# Altium schematic sheet 智能家居-窗帘-电力板.SchDoc
size A4
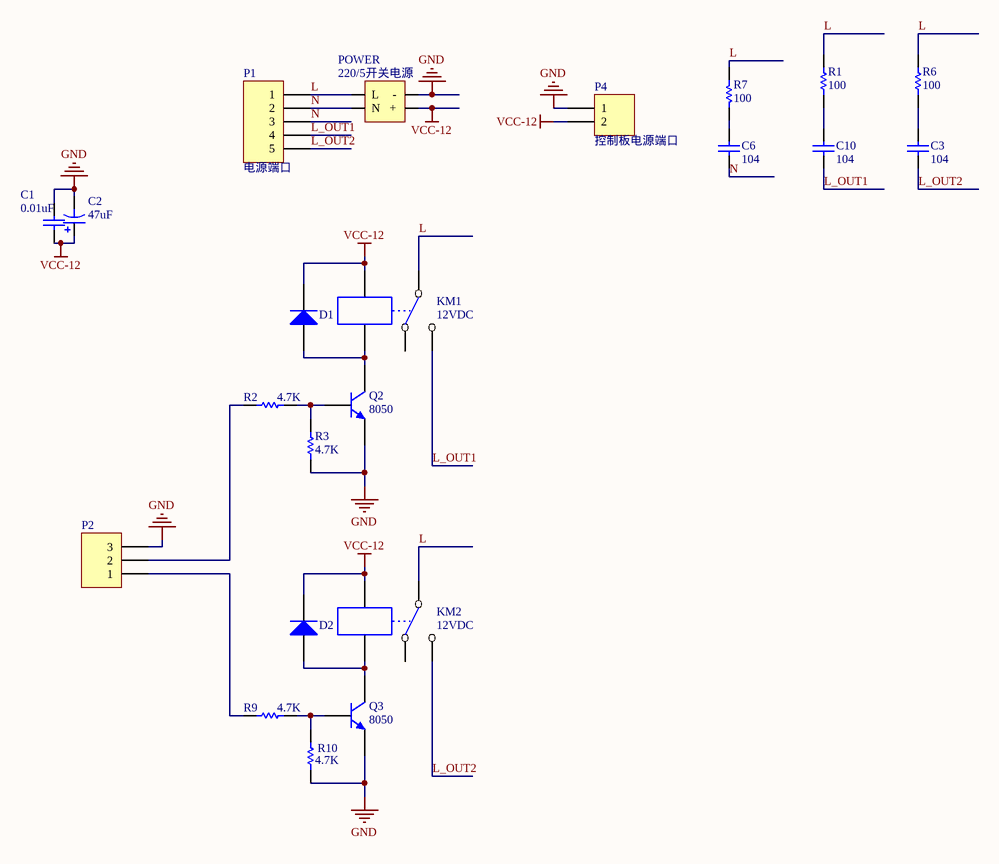
[diagram p0: 智能家居-窗帘-电力板.SchDoc]

## Parts
C1  0.01uF  [0.1UF]
C2  value 47uF  [CD5]  (hidden comment: Cap Pol1)
C3  value 104  [0.1UF/275V]  (hidden comment: Cap)
C6  value 104  [0.1UF/275V]  (hidden comment: Cap)
C10  value 104  [0.1UF/275V]  (hidden comment: Cap)
D1  Diode  [DIODE]  (value not drawn)
D2  Diode  [DIODE]  (value not drawn)
KM1  12VDC  [SRD_RELAY]
KM2  12VDC  [SRD_RELAY]
P1  电源端口  [JK128-500-5P]
P2  Header 3  [TJC3-3A]  (value not drawn)
P4  控制板电源端口  [TJC3-2A]
POWER  220/5开关电源  [220/5开关电源]
Q2  8050  [TO-92D]
Q3  8050  [TO-92D]
R1  100  [AXIAL0.3]
R2  4.7K  [AXIAL0.3]
R3  4.7K  [AXIAL0.3]
R6  100  [AXIAL0.3]
R7  100  [AXIAL0.3]
R9  4.7K  [AXIAL0.3]
R10  4.7K  [AXIAL0.3]

## Nets
GND: C1.2 C2.2 P2.3 P4.1 POWER.3(-) Q2.1(E) Q3.1(E) R3.2 R10.2
VCC-12: C1.1 C2.1 D1.2(K) D2.2(K) KM1.1 KM2.1 P4.2 POWER.4(+)
L: KM1.5(COM) KM2.5(COM) P1.1 POWER.1(L) R1.2 R6.2 R7.1
L_OUT1: C10.1 KM1.3 P1.4
L_OUT2: C3.1 KM2.3 P1.5
N: C6.2 P1.2 P1.3 POWER.2(N)
NetC3_2: C3.2 R6.1
NetC6_1: C6.1 R7.2
NetC10_2: C10.2 R1.1
NetD1_1: D1.1(A) KM1.4 Q2.3(C)
NetD2_1: D2.1(A) KM2.4 Q3.3(C)
NetP2_1: P2.1 R9.1
NetP2_2: P2.2 R2.1
NetQ2_2: Q2.2(B) R2.2 R3.1
NetQ3_2: Q3.2(B) R9.2 R10.1

Not connected (* = marked no-connect by the designer): KM1 2; KM2 2

## Library data of the parts
C1 C3 C6 C10 = Cap: Capacitor; Published: 8-Jun-2000; LatestRevisionDate: 17-Jul-2002; LatestRevisionNote: Re-released for DXP Platform.; Publisher: Altium Limited; PackageDescription: Radial Cap, Thru-Hole; 2 Leads; 0.3 in Pin Spacing
  C1: PackageReference: 0.1UF; Value: 0.01uF
  C3 C6 C10: PackageReference: RAD-0.3
C2 = Cap Pol1: Polarized Capacitor (Radial); Published: 8-Jun-2000; LatestRevisionDate: 17-Jul-2002; LatestRevisionNote: Re-released for DXP Platform.; PackageReference: RB7.6-15; Publisher: Altium Limited; PackageDescription: Polarized Capacitor (Radial); 2 Leads
D1 D2 = Diode: Default Diode; Published: 8-Jun-2000; LatestRevisionDate: 17-Jul-2002; LatestRevisionNote: Re-released for DXP Platform.; PackageVersion: Sep-1996; PackageReference: SMC; Publisher: Altium Limited; PackageDescription: DO-214-AB/SMC; 2 C-Bend Leads; Body 7.9 x 5.9 mm, inc. leads (LxW); Code_JEDEC: DO-214-AB
KM1 KM2 = SRD-12VDC
P1 = Header 5: Header, 5-Pin; LatestRevisionDate: 17-Jul-2002; LatestRevisionNote: Re-released for DXP Platform.; Publisher: Altium Limited
P2 = Header 3: Header, 3-Pin; LatestRevisionDate: 17-Jul-2002; LatestRevisionNote: Re-released for DXP Platform.; Publisher: Altium Limited
P4 = Header 2: Header, 2-Pin; LatestRevisionDate: 17-Jul-2002; LatestRevisionNote: Re-released for DXP Platform.; Publisher: Altium Limited
Q2 Q3 = NPN: NPN Bipolar Transistor; Published: 8-Jun-2000; LatestRevisionDate: 17-Jul-2002; LatestRevisionNote: Re-released for DXP Platform.; PackageReference: TO-226-AA; Publisher: Altium Limited; PackageDescription: TO, Flat Index; 3 In-Line, Axial Leads; Body Dia. 4.8mm; Leads 0.55 x 0.51 mm (max); Code_JEDEC: TO-226-AA
R1-R3 R6 R7 R9 R10 = Res1: Resistor; Value: 1K; Published: 8-Jun-2000; Revision: July-2002: Re-released for DXP Platform.; Publisher: Altium Limited